# EAGLE design capteur (EAGLE 7.6.0)
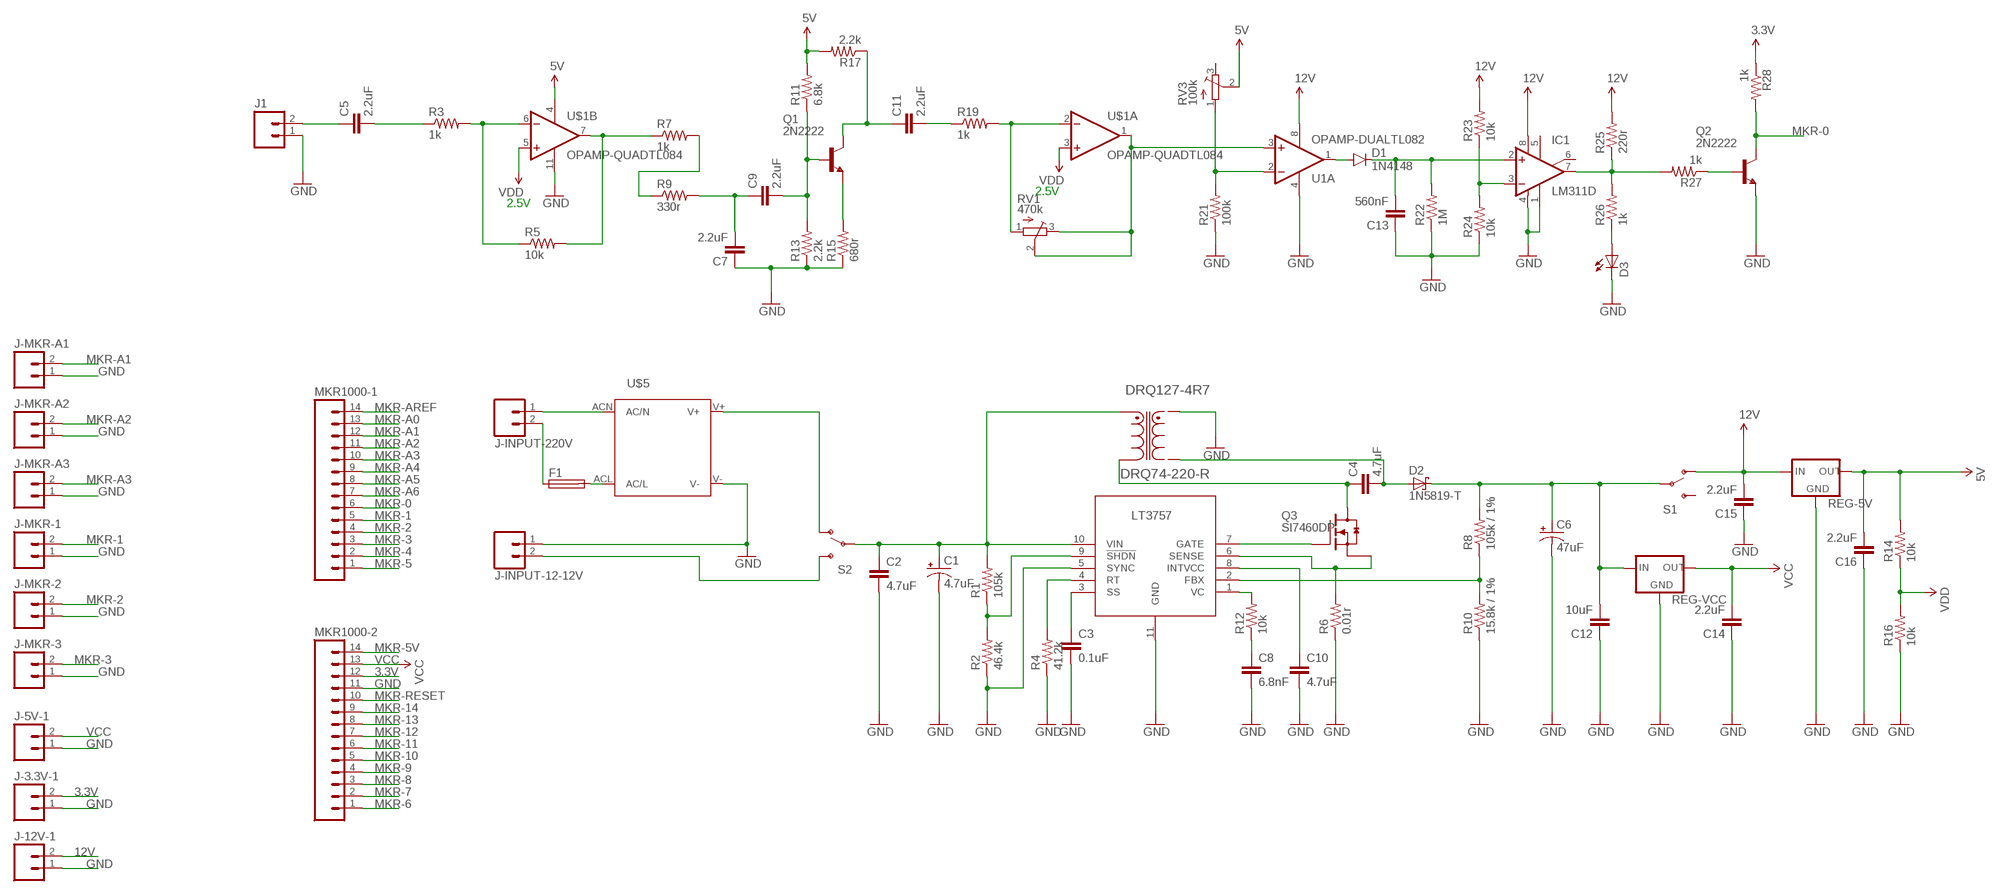
[diagram p0: schematic, sheet 1]

## Parts
C1  4.7uF  CAP_POLPTH2  [CPOL-RADIAL-10UF-25V]
C2  4.7uF  CAP0805  [0805]
C3  0.1uF  CAP0805  [0805]
C4  4.7uF  CAP0805  [0805]
C5  2.2uF  2.2UF-25V-+80/-20(0805)  [0805-CAP]
C6  47uF  CAP_POL1206  [EIA3216]
C7  2.2uF  2.2UF-25V-+80/-20(0805)  [0805-CAP]
C8  6.8nF  CAP0805  [0805]
C9  2.2uF  2.2UF-25V-+80/-20(0805)  [0805-CAP]
C10  4.7uF  CAP0805  [0805]
C11  2.2uF  2.2UF-25V-+80/-20(0805)  [0805-CAP]
C12  10uF  2.2UF-25V-+80/-20(0805)  [0805-CAP]
C13  560nF  2.2UF-25V-+80/-20(0805)  [0805-CAP]
C14  2.2uF  2.2UF-25V-+80/-20(0805)  [0805-CAP]
C15  2.2uF  2.2UF-25V-+80/-20(0805)  [0805-CAP]
C16  2.2uF  2.2UF-25V-+80/-20(0805)  [0805-CAP]
D1  1N4148  DIODESOD123  [SOD-123]
D2  1N5819-T  [DO41-7.6]
D3  LEDCHIPLED_0805  [CHIPLED_0805]
DRQ127-4R7  DRQ74-220-R  [IND_DRQ74-220-R]
F1  SH22,5A  [SH22,5A]
IC1  LM311D  [SO08]
J1  M025MM  [SCREWTERMINAL-5MM-2]
J-3.3V-1  M025MM  [SCREWTERMINAL-5MM-2]
J-5V-1  M025MM  [SCREWTERMINAL-5MM-2]
J-12V-1  M025MM  [SCREWTERMINAL-5MM-2]
J-INPUT-12-12V  M025MM  [SCREWTERMINAL-5MM-2]
J-INPUT-220V  M025MM  [SCREWTERMINAL-5MM-2]
J-MKR-1  M025MM  [SCREWTERMINAL-5MM-2]
J-MKR-2  M025MM  [SCREWTERMINAL-5MM-2]
J-MKR-3  M025MM  [SCREWTERMINAL-5MM-2]
J-MKR-A1  M025MM  [SCREWTERMINAL-5MM-2]
J-MKR-A2  M025MM  [SCREWTERMINAL-5MM-2]
J-MKR-A3  M025MM  [SCREWTERMINAL-5MM-2]
MKR1000-1  M14  [1X14]
MKR1000-2  M14  [1X14]
Q1  2N2222  [TO18]
Q2  2N2222  [TO18]
Q3  SI7460DP  SI7370  [POWERPAK-SO-08]
R1  105k  RESISTOR0805-RES  [0805]
R2  46.4k  RESISTOR0805-RES  [0805]
R3  1k  RESISTOR0805-RES  [0805]
R4  41.2k  RESISTOR0805-RES  [0805]
R5  10k  RESISTOR0805-RES  [0805]
R6  0.01r  0.001OHM-3W-1%(2512)3W/1%  [2512]
R7  1k  RESISTOR0805-RES  [0805]
R8  105k / 1%  RESISTOR0805-RES  [0805]
R9  330r  RESISTOR0805-RES  [0805]
R10  15.8k / 1%  RESISTOR0805-RES  [0805]
R11  6.8k  RESISTOR0805-RES  [0805]
R12  10k  RESISTOR0805-RES  [0805]
R13  2.2k  RESISTOR0805-RES  [0805]
R14  10k  RESISTOR0805-RES  [0805]
R15  680r  RESISTOR0805-RES  [0805]
R16  10k  RESISTOR0805-RES  [0805]
R17  2.2k  RESISTOR0805-RES  [0805]
R19  1k  RESISTOR0805-RES  [0805]
R21  100k  RESISTOR0805-RES  [0805]
R22  1M  RESISTOR0805-RES  [0805]
R23  10k  RESISTOR0805-RES  [0805]
R24  10k  RESISTOR0805-RES  [0805]
R25  220r  RESISTOR0805-RES  [0805]
R26  1k  RESISTOR0805-RES  [0805]
R27  1k  RESISTOR0805-RES  [0805]
R28  1k  RESISTOR0805-RES  [0805]
REG-5V  V_REG_78XXTO-92_UNTESTED  [TO-92]
REG-VCC  V_REG_78XXTO-92_UNTESTED  [TO-92]
RV1  470k  TRIM_EU-SM-42/43W  [SM-42/43W]
RV3  100k  TRIM_EU-SM-42/43W  [SM-42/43W]
S1  SWITCH-SPDT-1  [MHS122-1]
S2  SWITCH-SPDT-1  [MHS122-1]
U1  OPAMP-DUALTL082  [DIP8]
U$1  OPAMP-QUADTL084  [DIP14]
U$3  LT3757  [10-MSOP-EP]
U$5  IRM_45/60IRM_45/60  [IRM_45/60]

## Nets
3.3V: J-3.3V-1.2 MKR1000-2.12 R28.1
5V [ALIM]: C16.2 R11.2 R14.2 R17.2 REG-5V.1(OUT) RV3.2(S) U$1.4(SUP:VCC)
12V [ALIM]: C15.2 IC1.8(V+) J-12V-1.2 R23.2 R25.2 REG-5V.3(IN) S1.1(O) U1.8(SUP:VCC)
GND: C1.2(-) C2.2 C3.2 C6.C(-) C7.1 C8.2 C10.2 C12.1 C13.1 C14.1 C15.1 C16.1 D3.C DRQ127-4R7.2 IC1.1(GND) IC1.4(V-) J1.1 J-3.3V-1.1 J-5V-1.1 J-12V-1.1 J-INPUT-12-12V.1 J-MKR-1.1 J-MKR-2.1 J-MKR-3.1 J-MKR-A1.1 J-MKR-A2.1 J-MKR-A3.1 MKR1000-2.11 Q2.1(E) R2.1 R4.1 R6.1 R10.1 R13.1 R15.1 R16.1 R21.1 R22.1 R24.1 REG-5V.2(GND) REG-VCC.2(GND) U1.4(SUP:VEE) U$1.11(SUP:VEE) U$3.5(SYNC) U$3.11(GND) U$5.V-
MKR-0: MKR1000-1.6 Q2.3(C) R28.2
MKR-1: J-MKR-1.2 MKR1000-1.5
MKR-2: J-MKR-2.2 MKR1000-1.4
MKR-3: J-MKR-3.2 MKR1000-1.3
MKR-4: MKR1000-1.2
MKR-5: MKR1000-1.1
MKR-5V: MKR1000-2.14
MKR-6: MKR1000-2.1
MKR-7: MKR1000-2.2
MKR-8: MKR1000-2.3
MKR-9: MKR1000-2.4
MKR-10: MKR1000-2.5
MKR-11: MKR1000-2.6
MKR-12: MKR1000-2.7
MKR-13: MKR1000-2.8
MKR-14: MKR1000-2.9
MKR-A0: MKR1000-1.13
MKR-A1: J-MKR-A1.2 MKR1000-1.12
MKR-A2: J-MKR-A2.2 MKR1000-1.11
MKR-A3: J-MKR-A3.2 MKR1000-1.10
MKR-A4: MKR1000-1.9
MKR-A5: MKR1000-1.8
MKR-A6: MKR1000-1.7
MKR-AREF: MKR1000-1.14
MKR-RESET: MKR1000-2.10
N$1: C5.2 R3.1
N$2: R3.2 R5.1 U$1.6(B:IN-)
N$3: R5.2 R7.1 U$1.7(B:OUT)
N$4: R7.2 R9.1
N$5: C7.2 C9.1 R9.2
N$6: Q1.1(E) R15.2
N$7: C9.2 Q1.2(B) R11.1 R13.2
N$8: C11.1 Q1.3(C) R17.1
N$9: C11.2 R19.1
N$10: R19.2 RV1.1(A) U$1.2(A:IN-)
N$11: RV1.2(S) RV1.3(E) U1.3(A:IN+) U$1.1(A:OUT)
N$12: D1.A U1.1(A:OUT)
N$13: C13.2 D1.C IC1.2(+IN) R22.2
N$14: IC1.7(OUT) R25.1 R26.2 R27.2
N$15: R21.2 RV3.1(A) U1.2(A:IN-)
N$16: IC1.3(-IN) R23.1 R24.2
N$17: D3.A R26.1
N$18: Q2.2(B) R27.1
N$19: C5.1 J1.2
N$20: Q3.3(S3) R6.2 U$3.6(SENSE)
N$21 [220V]: J-INPUT-220V.1 U$5.ACN(AC/N)
N$22 [ALIM]: J-INPUT-12-12V.2 S2.3(S)
N$23 [ALIM]: S2.1(O) U$5.V+
N$24: C1.1(+) C2.1 DRQ127-4R7.1 R1.2 S2.2(P) U$3.10(VIN)
N$25: Q3.4(G) U$3.7(GATE)
N$26: R1.1 R2.2 U$3.9(!SHDN)
N$27 [ALIM]: F1.1 J-INPUT-220V.2
N$28 [ALIM]: C6.A(+) C12.2 D2.C R8.2 REG-VCC.3(IN) S1.2(P)
N$29 [ALIM]: C4.1 DRQ127-4R7.3 Q3.5-8(D)
N$30: C3.1 U$3.3(SS)
N$31 [ALIM]: C4.2 D2.A DRQ127-4R7.4
N$32: R4.2 U$3.4(RT)
N$33: R8.1 R10.2 U$3.2(FBX)
N$34: R12.2 U$3.1(VC)
N$35: C8.1 R12.1
N$36 [ALIM]: F1.2 U$5.ACL(AC/L)
N$37: C10.1 U$3.8(INTVCC)
VBAT: R14.1 R16.2 U$1.3(A:IN+) U$1.5(B:IN+) ; supply symbol labelled VDD
VCC [ALIM]: C14.2 J-5V-1.2 MKR1000-2.13 REG-VCC.1(OUT)
Unconnected: IC1.5(ON) IC1.6(ON/STR) Q3.1(S1) Q3.2(S2) RV3.3(E) S1.3(S) U1.5(B:IN+) U1.6(B:IN-) U1.7(B:OUT) U$1.8(C:OUT) U$1.9(C:IN-) U$1.10(C:IN+) U$1.12(D:IN+) U$1.13(D:IN-) U$1.14(D:OUT)

## Notes on the sheet
- 2.5V
- 2.5V

## Library data of the parts
C1 = SparkFun-Passives:CAP_POL: Capacitor Polarized These are standard SMD and PTH capacitors. Normally 10uF, 47uF, and 100uF in electrolytic and tantalum varieties. Always verify the external diameter of the through hole cap, it varies with capacity, voltage, and manufacturer. The EIA devices should be standard.
C2-C4 C8 C10 = SparkFun-Capacitors:CAP: Capacitor Standard 0603 ceramic capacitor, and 0.1" leaded capacitor.
C5 C7 C9 C11 C14-C16 = SparkFun-Capacitors:2.2UF-25V-+80/-20(0805): CAP-11624; PROD_ID: CAP-11624
C6 = SparkFun-Capacitors:CAP_POL: Capacitor Polarized These are standard SMD and PTH capacitors. Normally 10uF, 47uF, and 100uF in electrolytic and tantalum varieties. Always verify the external diameter of the through hole cap, it varies with capacity, voltage, and manufacturer. The EIA devices should be standard.
C12 C13 = SparkFun-Capacitors:2.2UF-25V-+80/-20(0805): CAP-11624; PROD_ID: CAP-11624; VALUE: 2.2uF
D1 = SparkFun-DiscreteSemi:DIODE: Diode These are standard reverse protection diodes and small signal diodes. SMA package can handle up to about 1A. SOD-323 can handle about 200mA. What the SOD-323 package when ordering, there are some mfgs out there that are 5-pin packages.
D2 = diode:1N581*: 1.0A SCHOTTKY BARRIER RECTIFIER Source: http://www.diodes.com/datasheets/ds23001.pdf
D3 = led:LED: LED OSRAM: - CHIPLED LG R971, LG N971, LY N971, LG Q971, LY Q971, LO R971, LY R971 LH N974, LH R974 LS Q976, LO Q976, LY Q976 LO Q996 - Hyper CHIPLED LW Q18S LB Q993, LB Q99A, LB R99A - SideLED LS A670, LO A670, LY A670, LG A670, LP A670 LB A673, LV A673, LT A673, LW A673 LH A674 LY A675 LS A676, LA A676, LO A676, LY A676, LW A676 LS A679, LY A679, LG A679 - Hyper Micro SIDELED® LS Y876, LA Y876, LO Y876, LY Y876 LT Y87S - SmartLED LW L88C, LW L88S LB L89C, LB L89S, LG L890 LS L89K, LO L89K, LY L89K LS L896, LA L896, LO L896, LY L896 - TOPLED LS T670, LO T670, LY T670, LG T670, LP T670 LSG T670, LSP T670, LSY T670, LOP T670, LYG T670 LG T671, LOG T671, LSG T671 LB T673, LV T673, LT T673, LW T673 LH T674 LS T676, LA T676, LO T676, LY T676, LB T676, LH T676, LSB T676, LW T676 LB T67C, LV T67C, LT T67C, LS T67K, LO T67K, LY T67K, LW E67C LS E67B, LA E67B, LO E67B, LY E67B, LB E67C, LV E67C, LT E67C LW T67C LS T679, LY T679, LG T679 LS T770, LO T770, LY T770, LG T770, LP T770 LB T773, LV T773, LT T773, LW T773 LH T774 LS E675, LA E675, LY E675, LS T675 LS T776, LA T776, LO T776, LY T776, LB T776 LHGB T686 LT T68C, LB T68C - Hyper Mini TOPLED® LB M676 - Mini TOPLED Santana® LG M470 LS M47K, LO M47K, LY M47K Source: http://www.osram.convergy.de LUXEON: - LUMILED® LXK2-PW12-R00, LXK2-PW12-S00, LXK2-PW14-U00, LXK2-PW14-V00 LXK2-PM12-R00, LXK2-PM12-S00, LXK2-PM14-U00 LXK2-PE12-Q00, LXK2-PE12-R00, LXK2-PE12-S00, LXK2-PE14-T00, LXK2-PE14-U00 LXK2-PB12-K00, LXK2-PB12-L00, LXK2-PB12-M00, LXK2-PB14-N00, LXK2-PB14-P00, LXK2-PB14-Q00 LXK2-PR12-L00, LXK2-PR12-M00, LXK2-PR14-Q00, LXK2-PR14-R00 LXK2-PD12-Q00, LXK2-PD12-R00, LXK2-PD12-S00 LXK2-PH12-R00, LXK2-PH12-S00 LXK2-PL12-P00, LXK2-PL12-Q00, LXK2-PL12-R00 Source: www.luxeon.com KINGBRIGHT: KA-3528ASYC Source: www.kingbright.com
DRQ127-4R7 = Coiltronics_By_element14_Batch_1:DRQ74-220-R: INDUCTOR SHIELD DUAL 22UH SMD; CURRENT: 874mA; INDUCTANCE: 22µH; MPN: DRQ74-220-R; OC_FARNELL: 1704164; OC_NEWARK: 27K7276; PACKAGE: SMD; SUPPLIER: Coiltronics; TOLERANCE: ±20%
F1 = fuse:SH22,5A: FUSE HOLDER grid 22,5mm, isolated cap OGN0031 8201, Schurter (Buerklin); MPN: 0031.7701.11; OC_FARNELL: unknown; OC_NEWARK: 04F1224
IC1 = linear:LM311: COMPARATOR
J1 J-3.3V-1 J-5V-1 J-12V-1 J-INPUT-12-12V J-INPUT-220V J-MKR-1-J-MKR-3 J-MKR-A1-J-MKR-A3 = SparkFun-Connectors:M02: Standard 2-pin 0.1" header. Use with - straight break away headers ( PRT-00116) - right angle break away headers (PRT-00553) - swiss pins (PRT-00743) - machine pins (PRT-00117) - female headers (PRT-00115) Molex polarized connector foot print use with: PRT-08233 with associated crimp pins and housings. 2.54_SCREWTERM for use with PRT-10571. 3.5mm Screw Terminal footprints for PRT-08084 5mm Screw Terminal footprints for use with PRT-08432; STOREFRONT_ID: PRT-08432
MKR1000-1 MKR1000-2 = SparkFun-Connectors:M14: Header 14 Standard 14-pin 0.1" header. Use with straight break away headers (SKU : PRT-00116), right angle break away headers (PRT-00553), swiss pins (PRT-00743), machine pins (PRT-00117), and female headers (PRT-00115).
Q1 Q2 = transistor:2N2222: NPN TRANSISTOR
Q3 = transistor-fet:SI7370: N-Channel MOSFET - 60v
R1-R5 R7-R17 R19 R21-R28 = SparkFun-Resistors:RESISTOR: Resistor Basic schematic elements and footprints for 0603, 1206, and PTH resistors.
R6 = SparkFun-Resistors:0.001OHM-3W-1%(2512); PROD_ID: RES-12449; VALUE: 0.001
REG-5V REG-VCC = SparkFun-PowerIC:V_REG_78XX: Voltage Regulator Standard 78xx regulator. IGO (Input Ground Output). Spark Fun Electronics SKU : COM-00107
RV1 RV3 = pot:TRIM_EU-: POTENTIOMETER
S1 S2 = lio:SWITCH-SPDT: SPDT Switch Simple slide switch, Spark Fun Electronics SKU : COM-00102 DPDT SMT slide switch, AYZ0202, SWCH-08179
U1 = Op-Amps:OPAMP-DUAL: Operational amplifier, dual; SPICE: X{NAME}A {A.IN+.NET} {A.IN-.NET} {VCC.NET} {VEE.NET} {A.OUT.NET} TL082\nX{NAME}B {B.IN+.NET} {B.IN-.NET} {VCC.NET} {VEE.NET} {B.OUT.NET} TL082; SPICEMOD: .SUBCKT TL082 1 2 3 4 5\nC1 11 12 3.498E-12\nC2 6 7 15.00E-12\nDC 5 53 DX\nDE 54 5 DX\nDLP 90 91 DX\nDLN 92 90 DX\nDP 4 3 DX\nEGND 99 0 POLY(2) (3,0) (4,0) 0 .5 .5\nFB 7 99 POLY(5) VB VC VE VLP VLN 0 4.715E6 -5E6 5E6 5E6 -5E6\nGA 6 0 11 12 282.8E-6\nGCM 0 6 10 99 8.942E-9\nISS 3 10 DC 195.0E-6\nHLIM 90 0 VLIM 1K\nJ1 11 2 10 JX\nJ2 12 1 10 JX\nR2 6 9 100.0E3\nRD1 4 11 3.536E3\nRD2 4 12 3.536E3\nRO1 8 5 150\nRO2 7 99 150\nRP 3 4 2.143E3\nRSS 10 99 1.026E6\nVB 9 0 DC 0\nVC 3 53 DC 2.200\nVE 54 4 DC 2.200\nVLIM 7 8 DC 0\nVLP 91 0 DC 25\nVLN 0 92 DC 25\n.MODEL DX D(IS=800.0E-18)\n.MODEL JX PJF(IS=15.00E-12 BETA=270.1E-6 VTO=-1)\n.ENDS
U$1 = Op-Amps:OPAMP-QUAD: Operational amplifier, quad; SPICE: X{NAME}A {A.IN+.NET} {A.IN-.NET} {VCC.NET} {VEE.NET} {A.OUT.NET} TL084\nX{NAME}B {B.IN+.NET} {B.IN-.NET} {VCC.NET} {VEE.NET} {B.OUT.NET} TL084\nX{NAME}C {C.IN+.NET} {C.IN-.NET} {VCC.NET} {VEE.NET} {C.OUT.NET} TL084\nX{NAME}D {D.IN+.NET} {D.IN-.NET} {VCC.NET} {VEE.NET} {D.OUT.NET} TL084; SPICEMOD: .SUBCKT TL084 1 2 3 4 5\nC1 11 12 3.498E-12\nC2 6 7 15.00E-12\nDC 5 53 DX\nDE 54 5 DX\nDLP 90 91 DX\nDLN 92 90 DX\nDP 4 3 DX\nEGND 99 0 POLY(2) (3,0) (4,0) 0 .5 .5\nFB 7 99 POLY(5) VB VC VE VLP VLN 0 4.715E6 -5E6 5E6 5E6 -5E6\nGA 6 0 11 12 282.8E-6\nGCM 0 6 10 99 8.942E-9\nISS 3 10 DC 195.0E-6\nHLIM 90 0 VLIM 1K\nJ1 11 2 10 JX\nJ2 12 1 10 JX\nR2 6 9 100.0E3\nRD1 4 11 3.536E3\nRD2 4 12 3.536E3\nRO1 8 5 150\nRO2 7 99 150\nRP 3 4 2.143E3\nRSS 10 99 1.026E6\nVB 9 0 DC 0\nVC 3 53 DC 2.200\nVE 54 4 DC 2.200\nVLIM 7 8 DC 0\nVLP 91 0 DC 25\nVLN 0 92 DC 25\n.MODEL DX D(IS=800.0E-18)\n.MODEL JX PJF(IS=15.00E-12 BETA=270.1E-6 VTO=-1)\n.ENDS
U$3 = PowerIC:LT3757
U$5 = meanwell_irm_v7:IRM_45/60: 45 or 60 watt housing & pin compatible IRM 45 Vout [V] Imax [A] Pmax [W] Eff [%] 5 8 40 83.5 12 3.8 45.6 87.5 15 3 45 88.5 24 1.9 45.6 89.5 48 0.94 45.12 90.5 IRM 60 Vout [V] Imax [A] Pmax [W] Eff [%] 5 10 50 84 12 5 60 87.5 15 4 60 89 24 2.5 60 90 48 1.25 60 91

## Net classes
0 default: width 0.3 mm
1 ALIM: width 1 mm, clearance 0.1 mm
2 220V: width 2 mm, clearance 0.5 mm

## Board
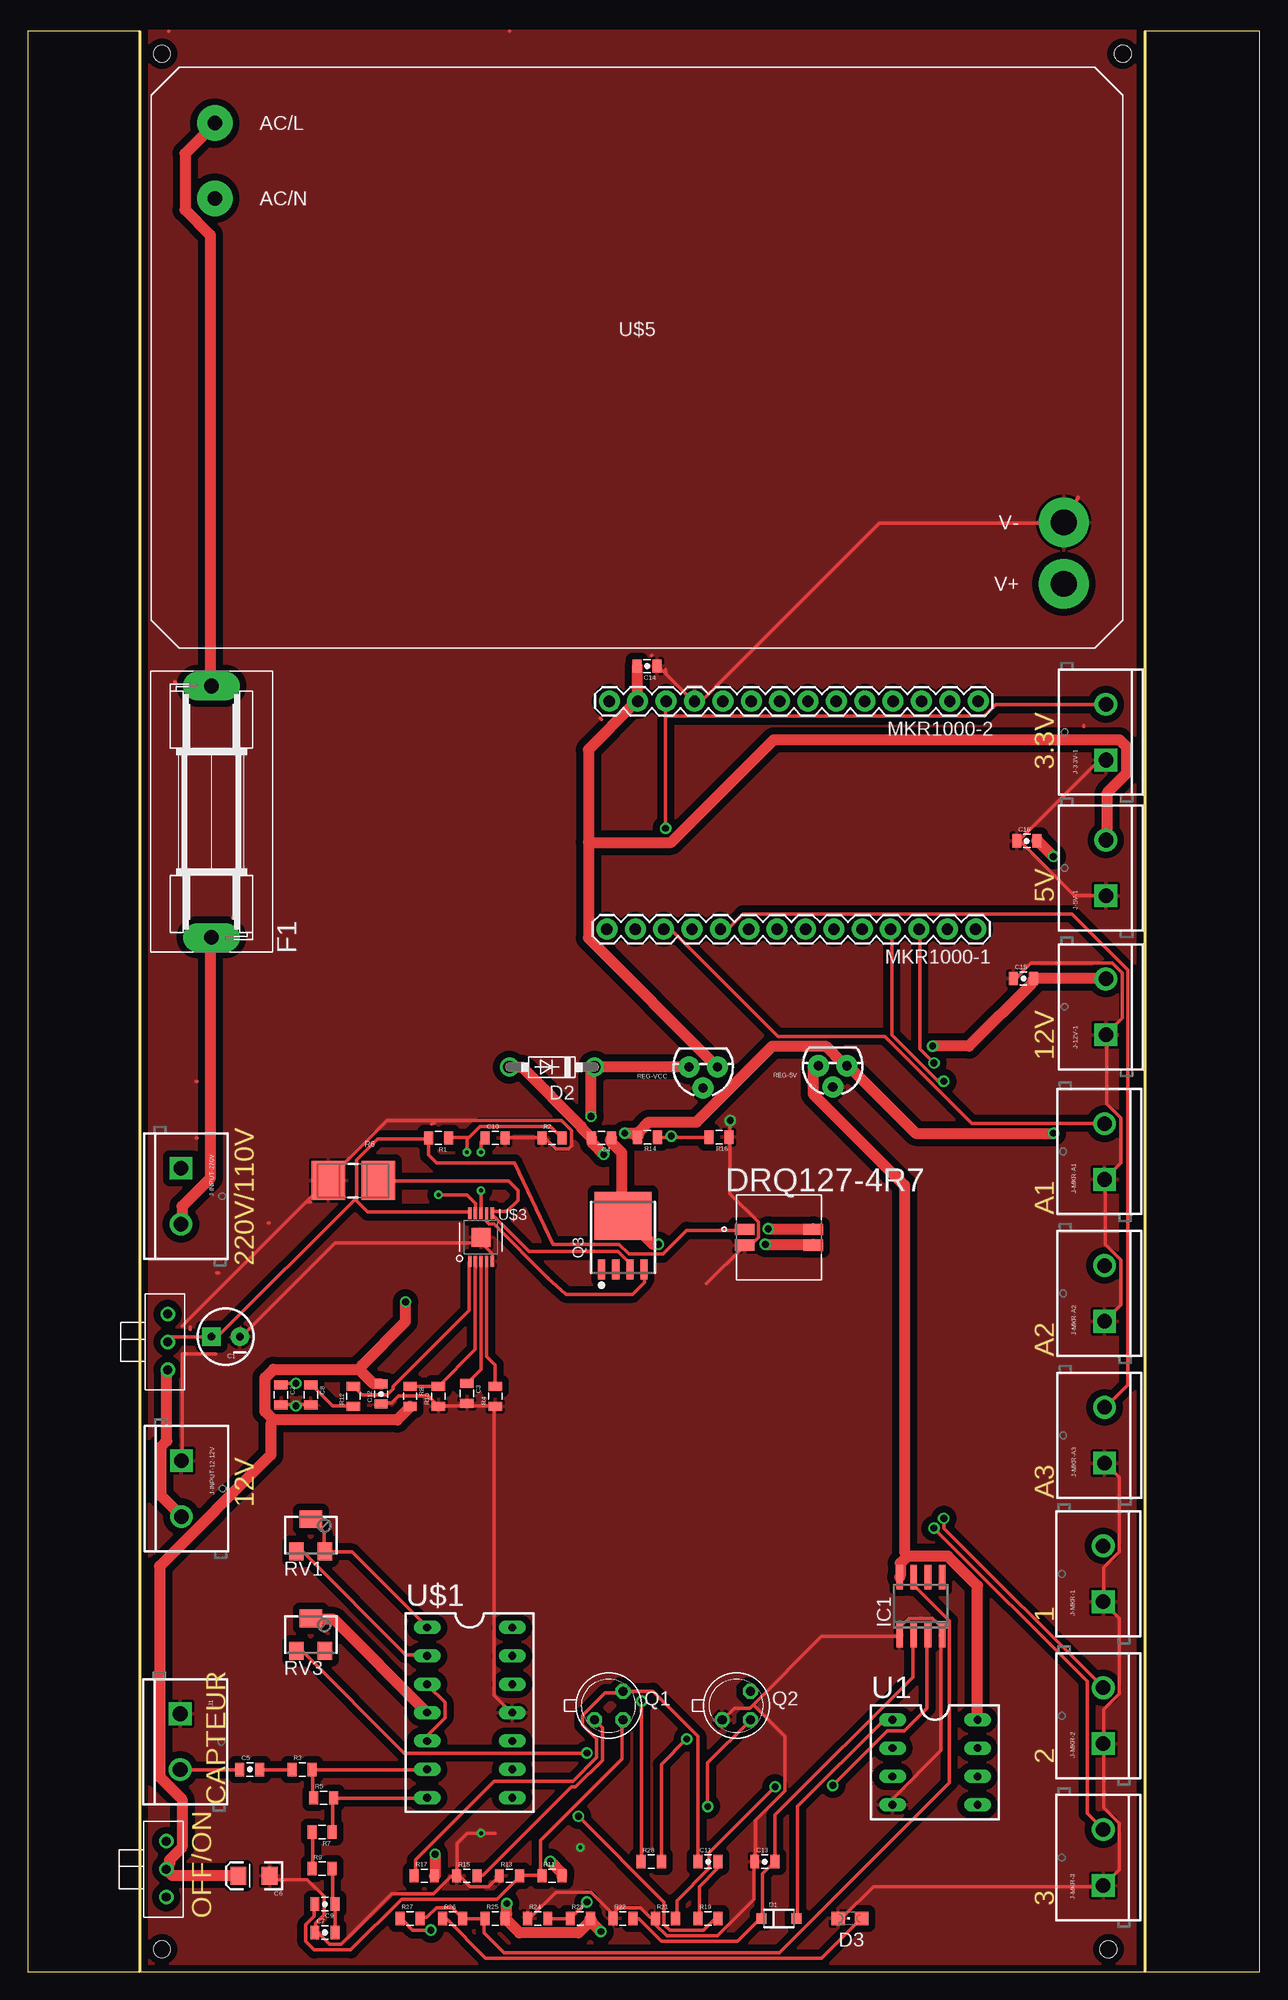
[diagram p1: board, top side]
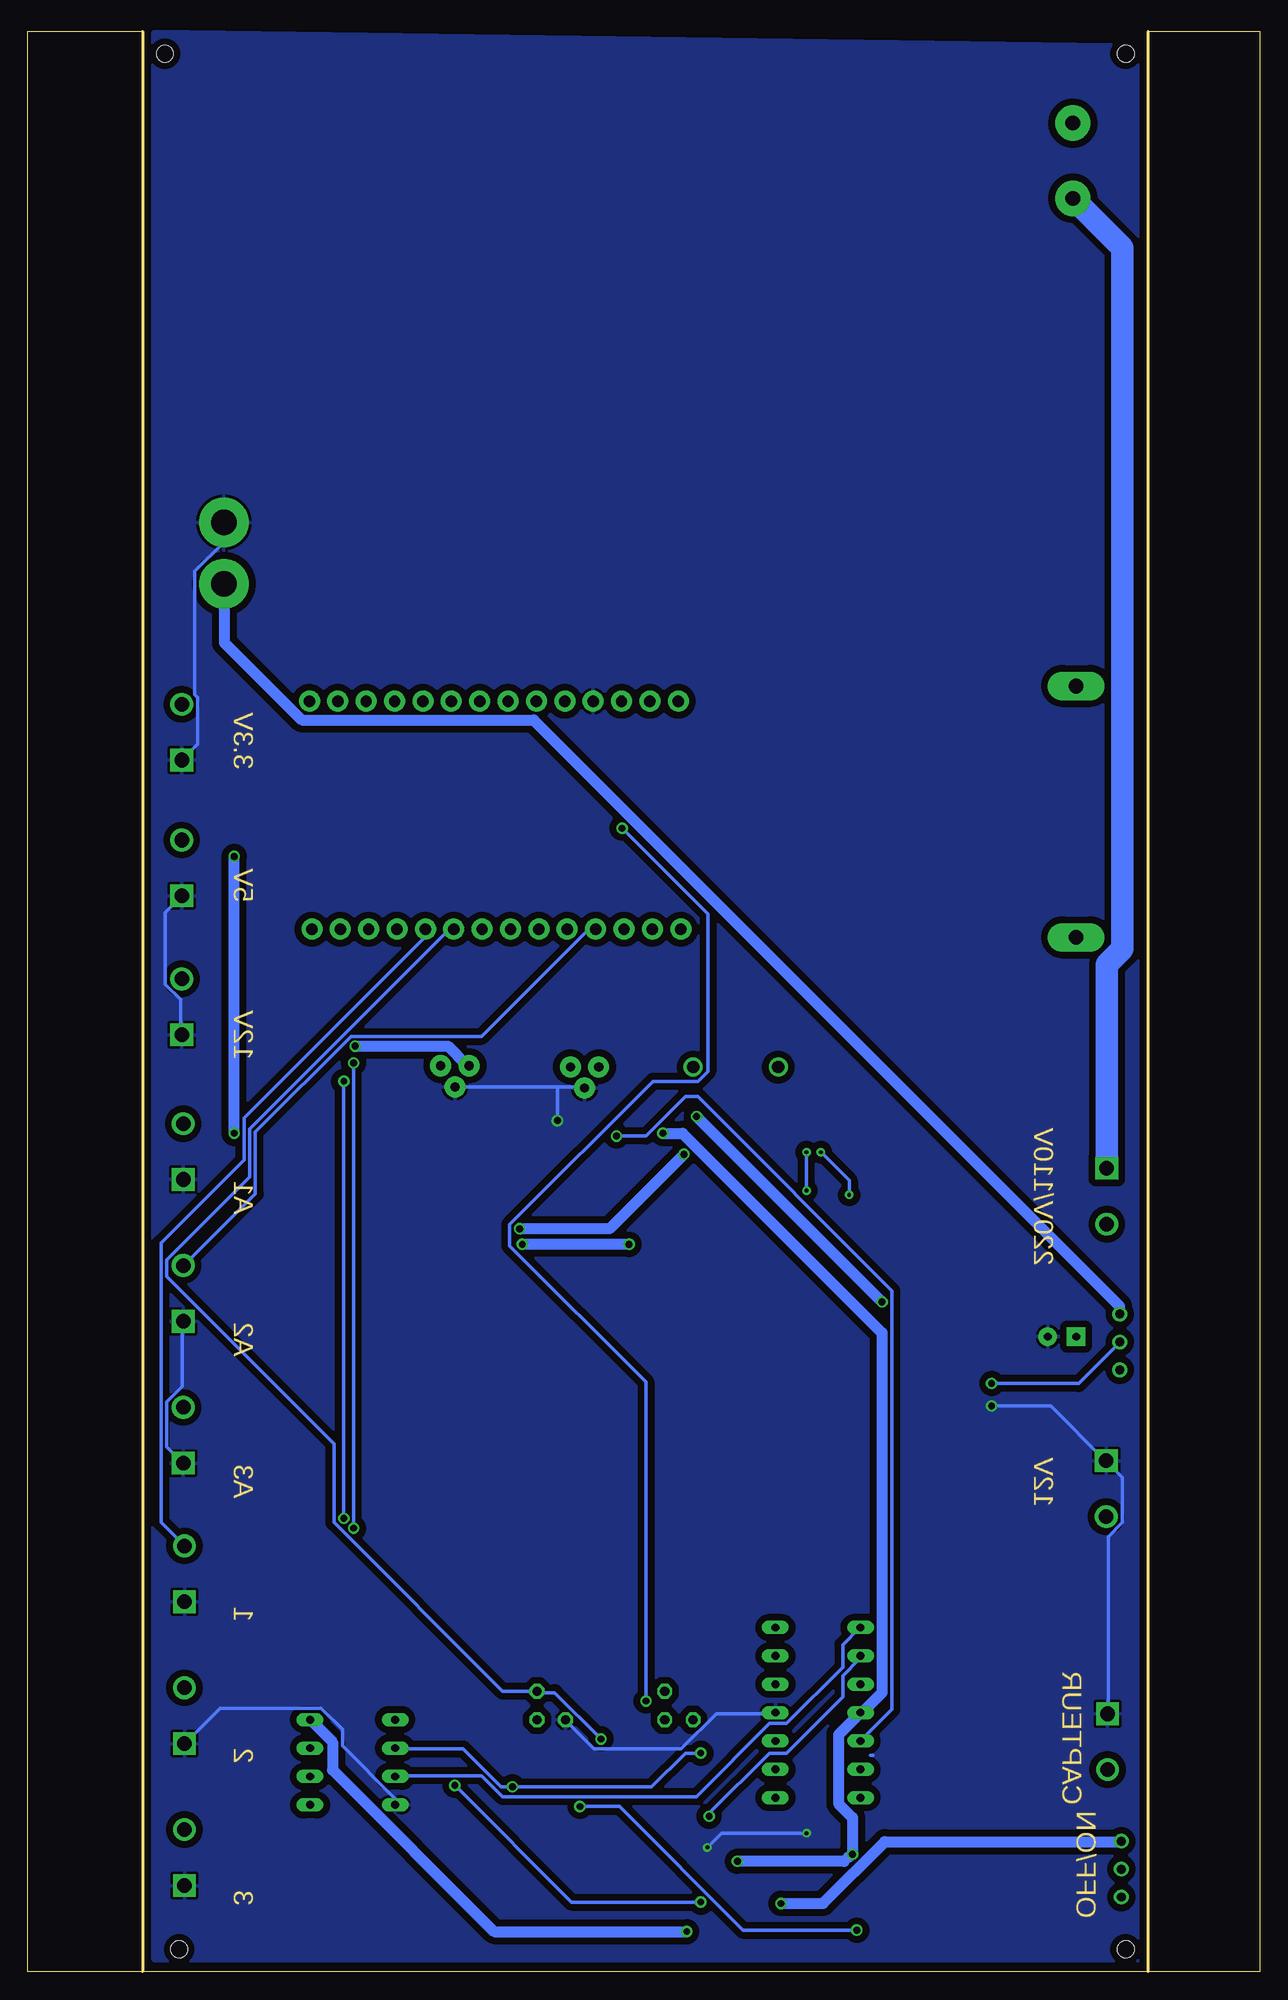
[diagram p2: board, bottom side, seen from below]

Size 110.27 x 173.66 mm. Coordinates in mm from the lower left corner, seen from the top.
Outline: 10,0 0,0 0,173.66 10,173.66 10,0
Outline: 10,0 100,0
Outline: 100,0 110.27,0 110.27,173.66 100,173.66 100,0
Copper layers (1*16): Top 0.035mm / dielectric 1.5mm / Bottom 0.035mm
Design rules "DRC": minimum track width 10mil, minimum drill 20mil, track to track 4mil, track to pad 4mil, pad to pad 2mil, via to via 2mil, smd to smd 2mil, copper to edge 20mil, drill to drill 8mil, minimum pad ring 10mil, minimum via ring 8mil, stop-mask expansion 4mil, vias tented up to drill 0mil, thermal gap 10mil
Holes 1.5 mm at 12,171.66 98,171.66 96.73,2 12,2

### Footprints (pad centres in the part's own frame; a part is rotated, then mirrored left to right if it is on the bottom)
CPOL-RADIAL-10UF-25V = drill 0.7 pad 1.651 square: 1 1.27,0 | drill 0.7 pad 1.651: 2 -1.27,0
0805 = smd 0.8 x 1.2: 1 -0.9,0; 2 0.9,0
0805-CAP = smd 0.8 x 1.2: 1 -0.9,0; 2 0.9,0
EIA3216 = smd 1.4 x 1.6: A 1.4,0; C -1.4,0
SOD-123 = smd 0.9 x 0.95: A 1.575,0; C -1.575,0
DO41-7.6 = drill 1.1 pad 1.7: A 3.81,0; C -3.81,0
CHIPLED_0805 = smd 1.2 x 1.2: A 0,-1.05; C 0,1.05
IND_DRQ74-220-R = smd 1.727 x 1.016: 1 -3.073,0.711; 2 -3.073,-0.711; 3 3.073,-0.711; 4 3.073,0.711
SH22,5A = drill 1.321 pad 2.54 long: 1 -11.252,0; 2 11.252,0
SO08 = smd 0.6 x 2.2: 1 -1.905,-2.6; 2 -0.635,-2.6; 3 0.635,-2.6; 4 1.905,-2.6; 5 1.905,2.6; 6 0.635,2.6; 7 -0.635,2.6; 8 -1.905,2.6
SCREWTERMINAL-5MM-2 = drill 1.3 pad 2.032 square: 1 0,0 | drill 1.3 pad 2.032: 2 5,0
1X14 = drill 1.016 pad 1.88: 1 0,0; 2 2.54,0; 3 5.08,0; 4 7.62,0; 5 10.16,0; 6 12.7,0; 7 15.24,0; 8 17.78,0; 9 20.32,0; 10 22.86,0; 11 25.4,0; 12 27.94,0; 13 30.48,0; 14 33.02,0
TO18 = drill 0.813 octagon: 1 -1.27,-1.27; 2 1.27,-1.27; 3 1.27,1.27
POWERPAK-SO-08 = smd 0.635 x 1.778: 1 -1.905,-2.857; 2 -0.635,-2.857; 3 0.635,-2.857; 4 1.905,-2.857 | smd 5.08 x 4.318: 5-8 0,1.905
2512 = smd 3 x 3.5: 1 -2.25,0; 2 2.25,0
TO-92 = drill 0.813 pad 1.88: 1 -1.27,0; 2 0,1.905; 3 1.27,0
SM-42/43W = smd 1.3 x 1.6: 1 -1.27,-1.45; 3 1.27,-1.45 | smd 2 x 1.6: 2 0,1.45
MHS122-1 = drill 0.8: 1 -2.5,0; 2 0,0; 3 2.5,0
DIP8 = drill 0.7 long: 1 0,2.54; 2 0,0; 3 0,-2.54; 4 0,-5.08; 5 7.62,-5.08; 6 7.62,-2.54; 7 7.62,0; 8 7.62,2.54
DIP14 = drill 0.7 long: 1 0,7.62; 2 0,5.08; 3 0,2.54; 4 0,0; 5 0,-2.54; 6 0,-5.08; 7 0,-7.62; 8 7.62,-7.62; 9 7.62,-5.08; 10 7.62,-2.54; 11 7.62,0; 12 7.62,2.54; 13 7.62,5.08; 14 7.62,7.62
10-MSOP-EP = smd 0.305 x 1.016: 1 -1.001,-2.159; 2 -0.5,-2.159; 3 0,-2.159; 4 0.5,-2.159; 5 1.001,-2.159; 6 1.001,2.159; 7 0.5,2.159; 8 0,2.159; 9 -0.495,2.159; 10 -1.001,2.159 | smd 1.676 x 1.676: 11 0,0
IRM_45/60 = drill 1.3 pad 3.17: ACL -37.8,21; ACN -37.8,14.25 | drill 2.3 pad 4.45: V+ 38.2,-20.25; V- 38.2,-14.75

### Placement (x,y rotation side)
C1  17.7,56.83 180 top
C2  22.65,51.62 270 top
C3  39.29,51.75 270 top
C4  51.35,74.61 180 top
C5  19.86,18.09 0 top
C6  20.24,8.57 180 top
C7  26.59,3.49 0 top
C8  25.32,51.62 270 top
C9  26.59,6.03 180 top
C10  41.83,74.61 0 top
C11  60.88,9.84 0 top
C12  31.62,51.69 90 top
C13  65.96,9.84 0 top
C14  55.43,116.85 180 top
C15  89.11,88.89 0 top
C16  89.42,101.2 0 top
D1  67.23,4.76 0 top
D2  46.91,80.96 180 top
D3  73.58,4.76 90 top
DRQ127-4R7  67.23,65.72 0 top
F1  16.43,103.82 90 top
IC1  79.93,32.7 0 top
J1  13.63,23.07 270 top
J-3.3V-1  96.5,108.44 90 top
J-5V-1  96.5,96.28 90 top
J-12V-1  96.5,83.85 90 top
J-INPUT-12-12V  13.74,45.72 270 top
J-INPUT-220V  13.7,71.9 270 top
J-MKR-1  96.26,33.1 90 top
J-MKR-2  96.26,20.4 90 top
J-MKR-3  96.26,7.7 90 top
J-MKR-A1  96.37,70.9 90 top
J-MKR-A2  96.37,58.2 90 top
J-MKR-A3  96.37,45.5 90 top
MKR1000-1  84.85,93.31 180 top
MKR1000-2  85.07,113.71 180 top
Q1  51.99,23.81 0 top
Q2  63.42,23.81 0 top
Q3  53.26,65.72 0 top
R1  36.75,74.61 180 top
R2  46.91,74.61 0 top
R3  24.56,18.09 0 top
R4  41.83,51.5 90 top
R5  26.46,15.55 0 top
R6  29.13,70.8 0 top
R7  26.34,12.51 180 top
R8  34.21,51.5 270 top
R9  26.34,9.21 0 top
R10  36.75,51.5 90 top
R11  46.91,8.57 0 top
R12  29.13,51.5 90 top
R13  43.1,8.57 0 top
R14  55.46,74.69 180 top
R15  39.29,8.57 0 top
R16  61.87,74.69 180 top
R17  35.48,8.57 0 top
R19  60.88,4.76 0 top
R21  57.07,4.76 0 top
R22  53.26,4.76 0 top
R23  49.45,4.76 0 top
R24  45.64,4.76 0 top
R25  41.83,4.76 0 top
R26  38.02,4.76 0 top
R27  34.21,4.76 0 top
R28  55.8,9.84 0 top
REG-5V  72.04,81.08 180 top
REG-VCC  60.44,80.98 180 top
RV1  25.32,39.05 0 top
RV3  25.32,30.16 0 top
S1  12.38,9.17 270 top
S2  12.52,56.35 270 top
U1  77.39,20 0 top
U$1  35.73,23.18 0 top
U$3  40.56,65.72 0 top
U$5  54.53,144.46 0 top

### Tracks (layer width: path | path; a pad name or v marks a point on that pad's centre or on a via)
3.3V  (via drill 0.61)
  Top 0.3: v54.94,24.21 54.94,9.87 R28.1 | 57.08,112.4 57.08,113.66 MKR1000-2.12 | 57.08,112.4 v57.08,102.33 | 57.08,112.4 85.64,112.4 86.64,113.4 96.46,113.4 J-3.3V-1.2
  Bottom 0.3: v54.94,24.21 54.94,52.77 67.15,64.97 67.15,66.86 54.31,79.69 50.29,79.69 49.41,80.57 49.41,94.66 v57.08,102.33
5V  (via drill 0.61)
  Top 1: v36.45,10.5 36.45,8.61 R17.2 | v46.77,9.87 47.77,8.86 47.77,8.61 R11.2 | RV3.2 25.38,31.51 27.39,31.51 35.7,23.2 U$1.4 | v53.43,75.03 54.19,75.03 R14.2 54.69,75.16 55.57,76.04 59.85,76.04 66.64,82.83 71.42,82.83 72.93,81.32 REG-5V.1 73.44,81.07 79.47,75.03 v91.8,75.03 | v91.8,99.82 90.42,101.2 C16.2
  Bottom 1: v46.77,9.87 37.2,9.87 36.83,10.25 v36.45,10.5 36.45,13.77 37.71,15.03 37.71,21.19 35.82,23.08 U$1.4 35.32,23.46 33.81,24.97 33.81,57.17 51.67,75.03 v53.43,75.03 | v91.8,75.03 v91.8,99.82
12V  (via drill 0.61)
  Top 1: v42.87,6.1 42.87,5.21 R25.2 42.74,4.71 44,3.45 49.28,3.45 50.29,4.46 50.29,4.71 R23.2 50.66,4.21 v51.29,3.58 | 78.72,37.17 78.09,36.54 78.09,35.41 IC1.8 | 78.72,37.17 82.37,37.17 85.01,34.53 85.01,22.58 U1.8 | J-12V-1.2 96.46,88.87 90.04,88.87 C15.2 89.92,88.5 84.25,82.83 v80.98,82.83 | 78.72,37.17 78.47,37.55 78.47,70.38 70.29,78.56 70.29,80.7 70.67,81.07 REG-5V.3
  Bottom 1: v42.87,6.1 39.09,6.1 33.56,11.63 12.42,11.63 S1.1 | v80.98,82.83 72.68,82.83 71.05,81.2 70.79,81.2 REG-5V.3 | v51.29,3.58 68.53,3.58 83,18.05 83,20.56 85.01,22.58 U1.8
GND  (via drill 0.35, 0.61)
  Top 0.3: C12.1 31.67,50.88 32.55,50.88 33.18,51.51 35.82,51.51 36.7,50.63 R10.1 36.83,50.63 39.09,50.63 39.22,50.76 C3.2 39.22,50.63 41.73,50.63 R4.1 41.73,50.5 41.73,24.71 43.24,23.2 U$1.11 | 41.61,63.46 U$3.5 41.61,63.59 41.61,64.22 40.6,65.22 40.6,65.6 U$3.11 40.48,65.22 27.52,65.22 19.21,56.92 C1.2 19.09,56.79 | v62.87,76.17 62.87,74.78 R16.1 62.87,74.66 62.87,69.62 65.38,67.11 65.38,65.73 64.75,65.1 64.25,65.1 DRQ127-4R7.2 64.13,64.97 60.73,61.57 | R13.1 42.11,8.49 41.23,7.6 39.59,7.6 38.71,8.49 38.46,8.49 R15.1 38.34,8.49 37.83,8.49 36.32,6.98 32.55,6.98 28.02,2.45 27.02,2.45 25.88,3.58 C7.1 25.76,3.58 25.76,4.33 26.51,5.09 26.51,6.72 25,8.23 21.98,8.23 21.73,8.49 C6.C | 24,50.76 25.25,50.76 C8.2 | 24,50.76 22.74,50.76 C2.2 | v24,50.63 24,50.76 | C10.2 42.74,74.66 45.88,74.66 R2.1 46.14,74.53 46.39,74.53 47.27,73.65 48.4,73.65 48.65,73.9 48.65,75.29 47.77,76.17 32.17,76.17 26.89,70.88 R6.1 26.76,70.76 13.81,57.8 | 16.82,55.28 13.81,55.28 13.81,45.72 J-INPUT-12-12V.1 | R24.1 44.75,4.84 45,4.84 47.27,7.1 50.41,7.1 52.3,5.21 52.3,4.84 R22.1 52.43,5.21 52.93,5.72 54.82,5.72 55.7,4.84 56.08,4.84 R21.1 56.2,4.71 56.2,4.21 57.21,3.2 61.74,3.2 65.01,6.47 65.01,9.74 C13.1 65.13,9.87 65.13,13.52 67.77,16.16 67.77,21.07 64.94,23.9 | U1.4 77.46,15.03 77.46,15.53 81.74,19.81 81.74,30 IC1.4 81.74,30.12 81.74,30.88 80.98,31.63 78.84,31.63 78.09,30.88 78.09,30.12 IC1.1 77.96,30 71.05,30 64.94,23.9 | 64.94,23.9 64.63,23.58 63.24,23.58 62.24,22.58 Q2.1 | C14.1 56.45,116.8 59.6,113.66 MKR1000-2.11 59.72,113.78 60.35,113.78 76.2,129.63 92.68,129.63 U$5.V-
  Top 0.3: D3.C 72.56,4.84 72.93,4.84 75.7,7.6 96.2,7.6 J-MKR-3.1 96.33,7.73 97.72,9.12 97.72,13.27 96.33,14.65 96.33,20.31 J-MKR-2.1 96.33,20.44 96.33,23.46 97.72,24.84 97.72,31.63 96.33,33.02 J-MKR-1.1 96.33,33.14 96.33,36.16 97.72,37.55 97.72,44.21 96.46,45.47 J-MKR-A3.1 | C15.1 88.28,89 88.53,89 89.79,90.26 97.09,90.26 97.97,89.38 97.97,85.35 96.58,83.97 J-12V-1.1 96.58,83.71 96.58,77.68 97.84,76.42 97.84,72.39 96.46,71.01 J-MKR-A1.1 96.46,70.88 96.46,65.1 97.84,63.71 97.84,59.69 96.46,58.3 J-MKR-A2.1 | J-5V-1.1 96.46,96.29 93.69,96.29 88.78,101.2 88.53,101.2 C16.1 88.78,101.33 95.83,108.37 96.46,108.37 J-3.3V-1.1 | 55.8,117.79 55.87,117.86 | 15.16,74.61 15.06,74.61 | 14.53,57.46 14.53,57.7 | 18.34,94.3 18.41,94.47 | 17.06,62.55 16.92,62.55 | 94.53,111.44 94.53,111.52 | 51.35,112.08 51.21,112.21 | 21.51,66.99 21.59,66.99 | 25.32,68.9 25,68.89 | 57.07,116.52 57.13,116.2 | 26.59,72.07 26.73,72.07 | 13.26,115.25 13.13,115.48 | 36.11,75.88 36.4,75.97 | 93.9,131.76 94.05,131.99 | 15.16,79.69 15.06,79.69 | 43.1,173.67 | 12.62,173.67
  Top 0.305: 39.59,7.6 38.4,8.8 38.4,11.49 39.29,12.38 v40.56,12.38 41.83,12.38
  Bottom 0.3: 62.87,79.19 71.93,79.19 REG-5V.2 | 62.87,79.19 60.48,79.19 REG-VCC.2 | 62.87,79.19 v62.87,76.17 | v24,50.63 18.71,50.63 13.81,45.72 J-INPUT-12-12V.1 13.68,45.6 12.3,44.21 12.3,40.19 13.55,38.93 13.55,23.08 J1.1 | U$1.11 43.37,23.08 48.65,23.08 51.8,19.93 59.6,19.93 62.11,22.45 Q2.1 | J-12V-1.1 96.58,83.97 96.58,86.99 97.97,88.37 97.97,94.79 96.58,96.17 J-5V-1.1 | J-MKR-A2.1 96.46,58.18 96.46,52.39 97.84,51.01 97.84,46.98 96.46,45.6 J-MKR-A3.1 | U$5.V- 92.81,129.63 92.81,127.87 95.32,125.35 95.32,114.28 95.07,114.03 95.07,109.88 96.46,108.5 J-3.3V-1.1 | U1.4 77.46,15.03 77.46,15.53 82.11,20.18 82.11,21.7 84,23.58 93.06,23.58 96.2,20.44 J-MKR-2.1 | 34.84,19.36 34.63,19.36
  Bottom 0.305: v40.56,12.38 48.18,12.38 48.82,11.74 v49.45,11.11
  pour Top (isolate 0.61): 100.25,-0.32 11.35,-0.32 10.08,0.95 10.08,173.67 100.25,173.67
  pour Bottom (isolate 0.61): 98.98,173.67 100.25,172.4 100.25,2.22 98.98,0.95 10.08,0.95 10.08,172.4
MKR-0  (via drill 0.61)
  Top 0.3: v58.97,20.81 56.7,18.55 56.7,9.87 R28.2
  Bottom 0.3: v58.97,20.81 63.12,24.97 64.63,24.97 Q2.3 64.75,25.09 67.77,25.09 82.87,40.19 82.87,47.23 97.84,62.2 97.84,63.71 90.42,71.13 90.42,75.41 72.56,93.28 72.18,93.28 MKR1000-1.6
MKR-1
  Bottom 0.3: MKR1000-1.5 74.69,93.28 74.69,92.65 90.92,76.42 90.92,72.64 98.34,65.22 98.34,40.19 96.33,38.17 J-MKR-1.2
MKR-2  (via drill 0.61)
  Top 0.3: v81.99,79.69 81.49,79.69 77.33,83.84 77.33,93.28 MKR1000-1.4 | v81.99,40.56 81.99,39.68 96.2,25.47 J-MKR-2.2
  Bottom 0.3: v81.99,40.56 v81.99,79.69
MKR-3  (via drill 0.61)
  Top 0.3: v81.11,81.32 79.85,82.58 79.85,93.28 MKR1000-1.3 | v81.11,39.68 94.82,25.97 94.82,14.15 96.2,12.76 J-MKR-3.2
  Bottom 0.3: v81.11,39.68 v81.11,81.32
MKR-A1
  Top 0.3: MKR1000-1.12 56.95,93.28 57.58,93.28 67.15,83.71 76.71,83.71 84.51,75.92 96.33,75.92 J-MKR-A1.2
MKR-A2
  Bottom 0.3: MKR1000-1.11 59.47,93.28 60.1,93.28 69.66,83.71 81.36,83.71 89.92,75.16 89.92,69.62 96.33,63.21 J-MKR-A2.2
MKR-A3
  Top 0.3: MKR1000-1.10 62.11,93.4 62.74,93.4 64,94.66 93.44,94.66 98.47,89.63 98.47,52.52 96.46,50.5 J-MKR-A3.2
N$1
  Top 0.3: C5.2 20.85,18.05 23.62,18.05 R3.1
N$2
  Top 0.3: R5.1 25.5,15.66 25.5,18.05 R3.2 25.63,18.05 35.7,18.05 U$1.6
N$3
  Top 0.3: R7.1 27.27,12.51 27.27,15.53 R5.2 27.52,15.53 35.7,15.53 U$1.7
N$4
  Top 0.3: R9.1 25.5,9.24 25.5,12.39 R7.2
N$5
  Top 0.3: C7.2 27.52,3.58 27.52,5.97 C9.1 27.39,6.1 27.27,6.22 27.27,9.12 R9.2
N$6
  Top 0.3: R15.2 40.22,8.61 40.73,8.61 48.65,16.54 49.03,16.54 51.42,18.93 51.42,21.82 50.79,22.45 Q1.1
N$7
  Top 0.3: C9.2 25.63,5.97 25.63,4.96 24.88,4.21 24.88,2.7 25.63,1.94 28.9,1.94 33.43,6.47 41.98,6.47 44,8.49 R13.2 44.12,8.61 45.88,8.61 R11.1 45.88,8.74 45.88,11.76 53.18,19.05 53.18,22.45 Q1.2
N$8
  Top 0.3: R17.1 34.69,8.61 34.69,10 41.73,17.04 48.78,17.04 50.92,19.18 50.92,20.81 49.66,22.07 49.66,22.95 51.67,24.97 53.18,24.97 Q1.3 53.31,25.09 55.95,25.09 59.98,21.07 59.98,9.87 C11.1
N$9
  Top 0.3: R19.1 60.1,4.84 60.1,7.6 61.74,9.24 61.74,9.74 C11.2
N$10  (via drill 0.61)
  Top 0.3: v49.28,13.89 56.95,6.22 56.95,4.21 57.46,3.71 60.48,3.71 61.48,4.71 61.74,4.71 R19.2 | RV1.1 24.12,37.55 24.62,37.55 33.81,28.36 35.7,28.36 U$1.2
  Bottom 0.3: v49.28,13.89 49.28,14.15 43.87,19.56 42.36,19.56 37.33,24.59 37.33,26.48 35.82,27.98 35.82,28.24 U$1.2
N$11
  Top 0.3: RV1.2 25.38,40.44 26.51,39.31 26.51,37.67 RV1.3 26.64,37.55 29.03,37.55 35.7,30.88 U$1.1
  Bottom 0.3: U1.3 77.33,17.54 69.66,17.54 67.77,15.66 50.41,15.66 43.87,22.2 42.36,22.2 37.33,27.23 37.33,29.24 35.82,30.75 U$1.1
N$12
  Top 0.3: D1.A 68.91,4.84 68.91,14.78 76.58,22.45 77.33,22.45 U1.1
N$13
  Top 0.3: R22.2 54.19,4.71 54.69,4.71 56.7,2.7 63.5,2.7 65.51,4.71 D1.C 65.76,4.84 65.76,8.74 66.77,9.74 C13.2 66.89,9.87 66.89,14.02 79.22,26.35 79.22,30 IC1.2
N$14
  Top 0.3: R27.2 35.19,4.84 35.7,4.84 36.58,5.72 37.96,5.72 38.84,4.84 R26.2 38.97,4.71 40.85,4.71 R25.1 40.85,4.59 40.85,3.45 42.61,1.69 67.27,1.69 82.49,16.91 82.49,31.38 79.35,34.53 79.35,35.28 IC1.7
N$15  (via drill 0.61)
  Top 0.3: v66.89,16.54 60.98,10.62 60.98,9.24 58.09,6.35 58.09,4.84 R21.2 | v50.04,19.56 33.68,19.56 24.62,28.61 24.12,28.61 RV3.1
  Bottom 0.3: U1.2 77.33,19.93 71.3,19.93 67.9,16.54 v66.89,16.54 54.44,16.54 51.42,19.56 v50.04,19.56
N$16  (via drill 0.61)
  Top 0.3: R24.2 46.64,4.71 48.53,4.71 R23.1 48.65,4.84 v50.04,6.22 | v72.05,16.66 76.96,21.57 78.47,21.57 80.48,23.58 80.48,30 IC1.3
  Bottom 0.3: v50.04,6.22 61.61,6.22 v72.05,16.66
N$17
  Top 0.3: R26.1 37.2,4.71 37.46,4.71 40.98,1.19 71.05,1.19 74.57,4.71 D3.A
N$18  (via drill 0.61)
  Top 0.3: v36.07,3.71 34.44,3.71 33.43,4.71 R27.1 | v60.85,14.78 60.85,18.68 64.63,22.45 Q2.2
  Bottom 0.3: v36.07,3.71 46.26,3.71 57.33,14.78 v60.85,14.78
N$19
  Top 0.3: C5.1 18.84,18.05 13.68,18.05 J1.2
N$20
  Top 0.3: 40.99,70.76 40.56,70.76 31.42,70.76 R6.2 | 41.61,67.99 U$3.6 41.61,67.74 44.88,64.47 52.8,64.47 53.81,63.46 53.81,62.96 Q3.3
  Top 0.305: 41.61,67.99 41.58,68.02 42.86,68.02 43.86,69.02 43.86,69.91 43.02,70.76 40.56,70.76
N$21
  Bottom 2: J-INPUT-220V.1 13.68,72.02 13.68,90.13 12.3,91.51 12.3,154.29 16.7,158.69 U$5.ACN
N$22
  Top 1: S2.3 12.42,53.77 12.42,47.48 11.92,46.98 11.92,42.58 13.68,40.82 J-INPUT-12-12V.2
N$23
  Bottom 1: S2.1 12.55,58.93 12.55,59.56 65.01,112.02 85.76,112.02 92.68,118.94 92.68,124.1 U$5.V+
N$24  (via drill 0.61)
  Top 0.3: v24,52.64 22.74,52.64 C2.1 | S2.2 12.55,56.42 12.93,56.79 16.2,56.79 C1.1 16.45,56.79 16.95,56.79 29.28,69.12 29.41,69.12 | 29.41,69.12 29.41,72.64 31.29,74.53 35.82,74.53 R1.2 35.95,74.53 | 29.41,69.12 29.41,69 30.41,67.99 39.47,67.99 U$3.10 | 43.55,72.38 47.03,65.1 52.93,65.1 53.81,64.22 56.83,64.22 58.97,66.35 64.13,66.35 DRQ127-4R7.1
  Top 0.305: 43.55,72.38 36.57,72.38 35.86,73.09 35.86,74.49 35.82,74.53
  Bottom 0.3: v24,52.64 16.2,52.64 12.55,56.29 S2.2
N$25
  Top 0.3: 46.53,62.1 48.17,60.63 48.16,60.67 | 55.19,62.83 Q3.4
  Top 0.305: U$3.7 41.06,67.12 41.27,66.91 41.72,66.91 46.53,62.1 46.55,62.08 | 48.17,60.63 54.13,60.63 55.19,61.69 55.19,62.83
N$26  (via drill 0.35)
  Top 0.3: R1.1 37.71,74.66 39.29,74.66 39.47,74.66 40.48,75.66 46.77,75.66 47.77,74.66 R2.2
  Top 0.305: 39.29,74.66 v39.29,73.34 | U$3.9 40.06,68.76 39.29,69.53 v36.75,69.53
  Bottom 0.305: v39.29,73.34 36.75,70.8 v36.75,69.53
N$27
  Top 1: J-INPUT-220V.2 13.81,66.98 13.81,68.49 16.32,71.01 16.32,92.52 F1.1
N$28  (via drill 0.61)
  Top 1: REG-VCC.3 59.09,80.95 50.79,80.95 D2.C 50.41,80.57 v50.41,76.54 | C6.A 18.84,8.61 12.93,8.61 12.42,9.12 S1.2 12.67,9.62 12.67,10 13.81,11.13 13.81,15.4 11.79,17.42 11.79,36.29 21.73,46.23 21.73,48.99 21.98,49.37 | 29.66,53.9 30.91,52.64 31.54,52.64 C12.2 | 29.66,53.9 21.98,53.9 21.23,53.15 21.23,50.13 21.98,49.37 | 21.98,49.37 33.05,49.37 34.19,50.5 R8.2 | v33.81,59.94 33.81,58.18 29.91,54.28 29.66,53.9
  Bottom 1: v33.81,59.94 v50.41,76.54
N$29  (via drill 0.61)
  Top 1: C4.1 52.17,74.53 52.17,74.28 53.18,73.27 53.18,67.74 Q3.5-8 53.69,67.36 55.95,65.1 v56.45,65.1 | v66.01,65.1 70.29,65.1 DRQ127-4R7.3
  Bottom 1: v56.45,65.1 v66.01,65.1
N$30
  Top 0.305: C3.1 40.55,53.91 40.55,62.89 40.56,62.9 U$3.3
N$31  (via drill 0.61)
  Top 1: D2.A 43.12,80.95 44.25,80.95 49.53,75.66 49.53,75.54 50.41,74.66 C4.2 50.54,74.15 v51.55,73.15 | v66.27,66.48 70.29,66.48 DRQ127-4R7.4
  Bottom 1: v66.27,66.48 58.21,66.48 v51.55,73.15
N$32
  Top 0.305: U$3.4 41.06,55.06 41.83,54.29 R4.2
N$33
  Top 0.3: R8.1 34.31,52.39 36.7,52.39 R10.2
  Top 0.305: R10.2 40.04,55.69 40.04,62.88 40.06,62.9 U$3.2
N$34
  Top 0.3: U$3.1 39.47,63.46 39.47,59.18 32.68,52.39 32.68,52.14 32.17,51.63 29.91,51.63 29.15,52.39 R12.2
N$35
  Top 0.3: R12.1 29.03,50.63 27.27,50.63 25.38,52.52 C8.1
N$36
  Top 1: F1.2 16.32,115.16 16.32,155.42 14.06,157.69 14.06,162.72 16.7,165.36 U$5.ACL
N$37  (via drill 0.35)
  Top 0.305: U$3.8 v40.56,69.91 40.56,69.78 | C10.1 40.56,74.24 v40.56,73.34
  Bottom 0.305: v40.56,69.91 v40.56,73.34
VBAT  (via drill 0.61)
  Top 0.3: 57.58,74.66 60.85,74.66 R16.2 | 57.58,74.66 56.45,74.66 R14.1 | U$1.5 35.82,20.69 35.82,21.19 37.33,22.7 37.33,24.09 35.82,25.59 U$1.3 | v57.58,74.78 57.58,74.66
  Bottom 0.3: v57.58,74.78 54.94,74.78 51.42,78.31 50.29,78.31 32.93,60.95 32.93,23.46 35.7,20.69 U$1.5
VCC
  Top 1: C14.2 54.56,116.8 54.56,113.78 MKR1000-2.13 54.19,113.4 50.16,109.38 50.16,101.08 | 50.16,101.08 50.16,92.52 61.61,81.07 REG-VCC.1 | 50.16,101.08 57.58,101.08 66.77,110.26 97.72,110.26 98.34,109.63 98.34,107.24 96.58,105.48 96.58,101.33 J-5V-1.2

### Text on the board
Dimension: 3.3V | 5V | 12V | A1 | 220V/110V | A2 | A3 | 12V | 1 | 2 | CAPTEUR | 3 | OFF/ON